# EAGLE design Crab_v2 (EAGLE 8.0.1)
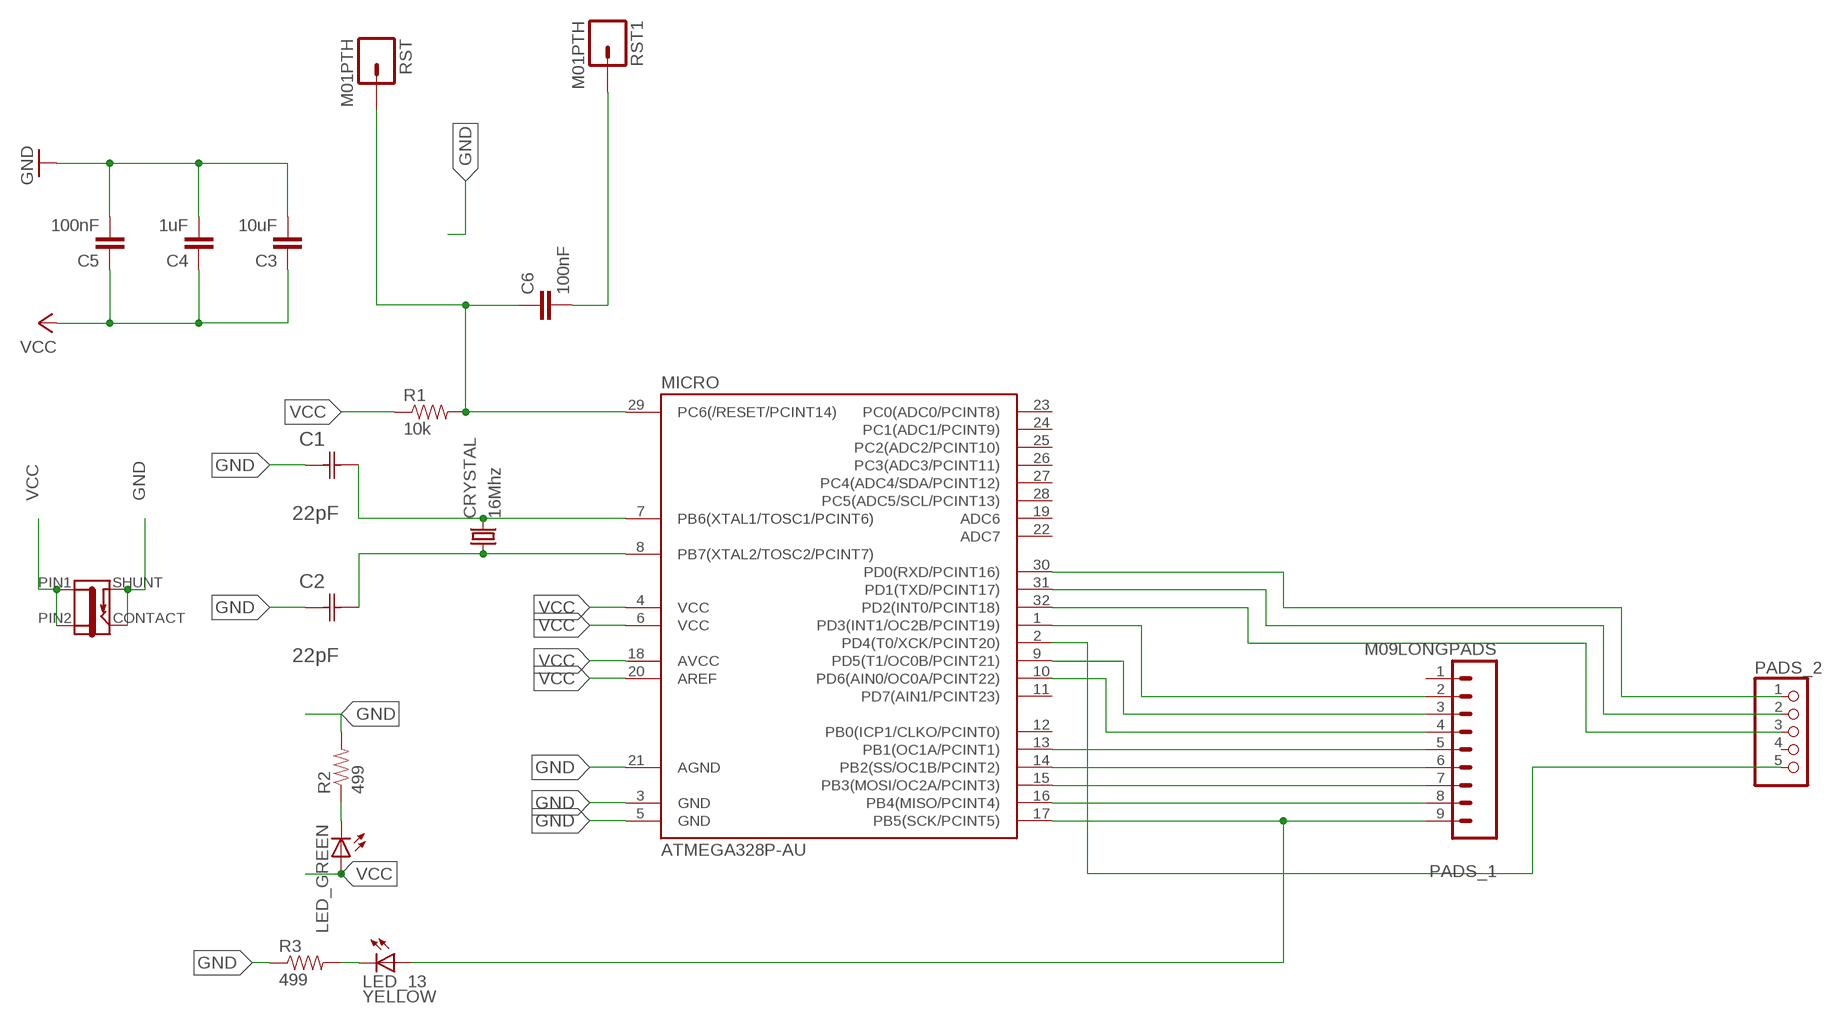
[diagram p0: schematic, sheet 1]

## Parts
C1  22pF  0612ZC225MAT2A  [CAPC3216X178N]
C2  22pF  0612ZC225MAT2A  [CAPC3216X178N]
C3  10uF  CAP1206  [1206]
C4  1uF  CAP1206  [1206]
C5  100nF  CAP1206  [1206]
C6  100nF  CAP1206  [1206]
CRYSTAL  16Mhz  CSM-7X-DU  [CSM-7X-DU]
J1  JACK-2.1MM  [PJ-002AH-SMT]
LED_13  YELLOW  LED1206  [1206]
LED_GREEN  LED1206  [1206]
MICRO  ATMEGA328P-AU  ATMEGA48/88/168-AU  [TQFP32-08]
PADS_1  M09LONGPADS  [1X09_LONGPADS]
PADS_2  PINHD-1X5  [1X05]
R1  10k  RESISTOR1206  [1206]
R2  499  RESISTOR1206  [1206]
R3  499  RESISTOR1206  [1206]
RST  M01PTH  [1X01]
RST1  M01PTH  [1X01]

## Nets
GND: C1.1(C1) C2.1(C1) C3.2 C4.2 C5.2 J1.CONTACT J1.SHUNT MICRO.3(GND) MICRO.5(GND) MICRO.21(AGND) R2.2 R3.1
N$1: MICRO.10(PD6(AIN0/OC0A/PCINT22)) PADS_1.4
N$2: C1.2(C2) CRYSTAL.2 MICRO.7(PB6(XTAL1/TOSC1/PCINT6))
N$3: MICRO.9(PD5(T1/OC0B/PCINT21)) PADS_1.3
N$4: MICRO.1(PD3(INT1/OC2B/PCINT19)) PADS_1.2
N$7: MICRO.13(PB1(OC1A/PCINT1)) PADS_1.5
N$8: MICRO.14(PB2(SS/OC1B/PCINT2)) PADS_1.6
N$9: C2.2(C2) CRYSTAL.1 MICRO.8(PB7(XTAL2/TOSC2/PCINT7))
N$10: MICRO.15(PB3(MOSI/OC2A/PCINT3)) PADS_1.7
N$11: MICRO.16(PB4(MISO/PCINT4)) PADS_1.8
N$12: LED_13.1(A) MICRO.17(PB5(SCK/PCINT5)) PADS_1.9
N$13: C6.2 RST1.1
N$20: MICRO.30(PD0(RXD/PCINT16)) PADS_2.1
N$21: MICRO.31(PD1(TXD/PCINT17)) PADS_2.2
N$22: MICRO.32(PD2(INT0/PCINT18)) PADS_2.3
N$24: MICRO.2(PD4(T0/XCK/PCINT20)) PADS_2.5
N$26: LED_GREEN.2(C) R2.1
N$27: LED_13.2(C) R3.2
N$28: C6.1 MICRO.29(PC6(/RESET/PCINT14)) R1.2 RST.1
VCC: C3.1 C4.1 C5.1 J1.PIN1 J1.PIN2 LED_GREEN.1(A) MICRO.4(VCC) MICRO.6(VCC) MICRO.18(AVCC) MICRO.20(AREF) R1.1
Unconnected: MICRO.11(PD7(AIN1/PCINT23)) MICRO.12(PB0(ICP1/CLKO/PCINT0)) MICRO.19(ADC6) MICRO.22(ADC7) MICRO.23(PC0(ADC0/PCINT8)) MICRO.24(PC1(ADC1/PCINT9)) MICRO.25(PC2(ADC2/PCINT10)) MICRO.26(PC3(ADC3/PCINT11)) MICRO.27(PC4(ADC4/SDA/PCINT12)) MICRO.28(PC5(ADC5/SCL/PCINT13)) PADS_1.1 PADS_2.4

## Library data of the parts
C1 C2 = AVX_By_element14_Batch_1:0612ZC225MAT2A: Capacitor 1206; MPN: 0612ZC225MAT2A; OC_FARNELL: -; OC_NEWARK: 12N3209; SUPPLIER: AVX; TOLERANCE: ±20%; VALUE: 2.2µF; VOLTAGERATING: 10V
C3-C6 = 01_SparkFun:CAP: Capacitor Standard 0603 ceramic capacitor, and 0.1" leaded capacitor.
CRYSTAL = 01_FAB_Hello:CSM-7X-DU: SMD CRYSTAL Source: www.ecsxtal.com .. Crystal 3.6864MHz CSM_7X_DU.PDF; OC_FARNELL: unknown; OC_NEWARK: unknown
J1 = fab:JACK-2.1MM: SMD DC power jack PJ-002AH-SMT As found in the fablab inventory. Made by Zaerc.
LED_13 LED_GREEN = 01_FAB_Hello:LED
MICRO = atmega8:ATMEGA48/88/168
PADS_1 = 01_SparkFun:M09: Header 9 Standard 9-pin 0.1" header. Use with straight break away headers (SKU : PRT-00116), right angle break away headers (PRT-00553), swiss pins (PRT-00743), machine pins (PRT-00117), and female headers (PRT-00115).
PADS_2 = pinhead:PINHD-1X5: PIN HEADER
R1-R3 = 01_SparkFun:RESISTOR: Resistor Basic schematic elements and footprints for 0603, 1206, and PTH 1/10th watt (small) resistors.
RST RST1 = 01_SparkFun:M01: Header 1 Standard 1-pin 0.1" header. Use with straight break away headers (SKU : PRT-00116), right angle break away headers (PRT-00553), swiss pins (PRT-00743), machine pins (PRT-00117), and female headers (PRT-00115).

## Board
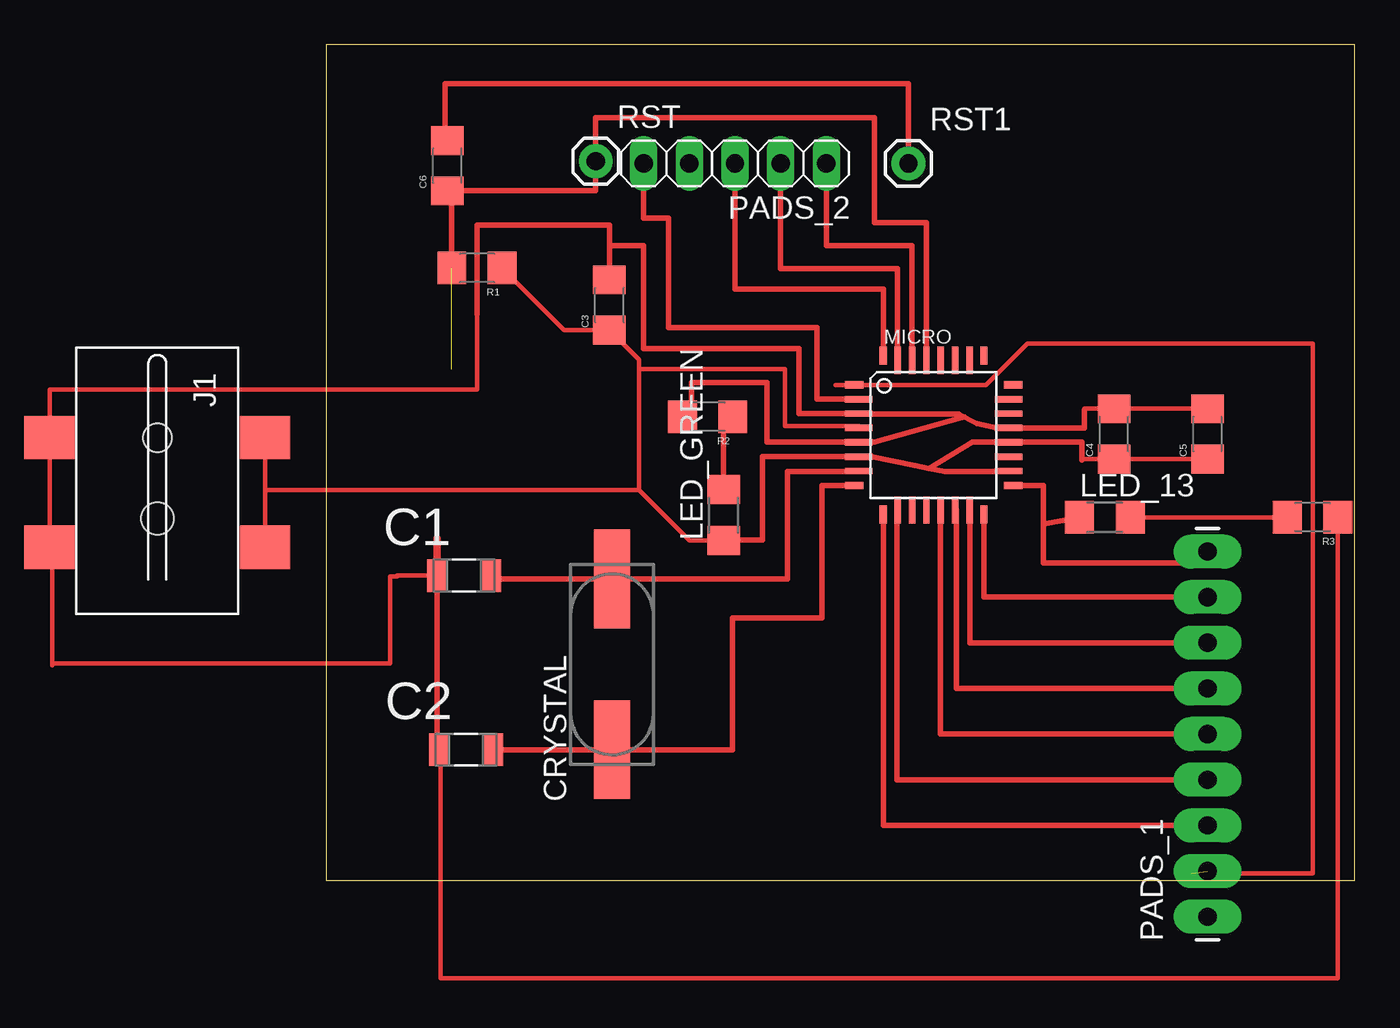
[diagram p1: board, top side]

Size 57.2 x 46.47 mm. Coordinates in mm from the lower left corner, seen from the top.
Outline: 0,0 57.2,0 57.2,46.47 0,46.47 0,0
Copper layers (1*16): Top 0.035mm / dielectric 1.5mm / Bottom 0.035mm
Design rules "fab": minimum track width 0.3mm, minimum drill 32mil, track to track 0.315mm, track to pad 0.315mm, pad to pad 0.315mm, via to via 0.315mm, smd to smd 0.315mm, copper to edge 40mil, drill to drill 16mil, minimum pad ring 10mil, minimum via ring 8mil, stop-mask expansion 4mil, vias tented up to drill 0mil, thermal gap 10mil

### Footprints (pad centres in the part's own frame; a part is rotated, then mirrored left to right if it is on the bottom)
CAPC3216X178N = smd 1.118 x 1.803: 1 -1.499,0; 2 1.499,0
1206 = smd 1.6 x 1.8: 1 -1.4,0; 2 1.4,0
CSM-7X-DU = smd 5.5 x 2: 1 -4.75,0; 2 4.75,0
PJ-002AH-SMT = smd 2.4 x 2.8: CONTACT -2.4,-6; PIN1 3.7,6; PIN2 -2.4,6; SHUNT 3.7,-6 | hole 1.6: -2.4,0 | hole 1.8: 2.1,0
1206' = smd 1.6 x 1.803: 1 -1.422,0; 2 1.422,0
TQFP32-08 = smd 1.016 x 0.406: 1 -4.42,2.8; 8 -4.42,-2.8; 17 4.42,-2.8; 24 4.42,2.8 | smd 1.524 x 0.356: 2 -4.166,2; 3 -4.166,1.2; 4 -4.166,0.4; 5 -4.166,-0.4; 6 -4.166,-1.2; 7 -4.166,-2; 18 4.166,-2; 19 4.166,-1.2; 20 4.166,-0.4; 21 4.166,0.4; 22 4.166,1.2; 23 4.166,2 | smd 0.406 x 1.016: 9 -2.8,-4.42; 16 2.8,-4.42; 25 2.8,4.42; 32 -2.8,4.42 | smd 0.356 x 1.524: 10 -2,-4.166; 11 -1.2,-4.166; 12 -0.4,-4.166; 13 0.4,-4.166; 14 1.2,-4.166; 15 2,-4.166; 26 2,4.166; 27 1.2,4.166; 28 0.4,4.166; 29 -0.4,4.166; 30 -1.2,4.166; 31 -2,4.166
1X09_LONGPADS = drill 1.016 pad 1.88 long: 1 0,0; 2 2.54,0; 3 5.08,0; 4 7.62,0; 5 10.16,0; 6 12.7,0; 7 15.24,0; 8 17.78,0; 9 20.32,0
1X05 = drill 1.016 long: 1 -5.08,0; 2 -2.54,0; 3 0,0; 4 2.54,0; 5 5.08,0
1X01 = drill 1.016 pad 1.88: 1 0,0

### Placement (x,y rotation side)
C1  7.67,16.94 0 top
C2  7.77,7.26 0 top
C3  15.75,32 90 top
C4  43.82,24.83 90 top
C5  49.02,24.83 90 top
C6  6.73,39.75 90 top
CRYSTAL  15.9,12.01 90 top
J1  -9.4,22.23 270 top  (outside the outline)
LED_13  YELLOW  [1206']  43.31,20.19 0 top
LED_GREEN  [1206']  22.1,20.32 90 top
MICRO  33.78,24.77 0 top
PADS_1  49.02,-2.03 90 top
PADS_2  22.73,39.88 180 top
R1  8.38,34.06 180 top
R2  21.21,25.78 180 top
R3  54.86,20.19 180 top
RST  14.99,40.01 0 top
RST1  32.39,39.88 0 top

### Tracks (layer width: path | path; a pad name or v marks a point on that pad's centre or on a via)
GND
  Top 0.254: R3.1 56.26,-5.08 56.26,-5.46 6.35,-5.46 6.35,7.26 C2.1 | 42.16,26.16 42.16,26.23 C4.2 C5.2 | C1.1 3.94,16.94 3.94,16.89 3.56,16.89 3.56,12.07 -15.24,12.07 -15.24,11.94 -15.24,18.37 J1.SHUNT J1.CONTACT -15.4,27.3 8.38,27.3 8.38,31.5
  Top 0.305: MICRO.5 | MICRO.21 | C2.1 6.17,7.26 C1.1 6.1,16.94 | MICRO.5 29.62,24.38 24.51,24.38 24.51,27.69 20.32,27.69 20.32,25.65 R2.2 20.32,25.91 | MICRO.5 30.23,24.38 30.48,24.38 35.36,25.73 | MICRO.21 37.34,25.15 36.2,25.4 35.17,25.94 | 15.75,35.31 17.65,35.31 17.65,29.59 26.29,29.59 26.29,25.96 MICRO.3 29.64,25.94 35.17,25.94 | 35.36,25.73 35.49,25.77 | 35.17,25.94 35.36,25.73 | C3.2 15.75,35.31 | 8.38,31.5 8.38,36.45 15.75,36.45 15.75,35.31 | MICRO.21 42.16,25.16 42.16,26.16 | C5.2 49.02,26.16
  Top 0.406: 6.17,19.02 C1.1
N$1
  Top 0.305: MICRO.10 31.75,20.6 31.75,5.59 PADS_1.4
N$2
  Top 0.305: 9.17,16.76 C1.2 9.17,16.76 | MICRO.7 29.62,22.73 25.65,22.73 25.65,16.76 CRYSTAL.2 9.17,16.76
N$3
  Top 0.305: PADS_1.3 30.98,3.05 MICRO.9
N$4  (1 unrouted)
  Top 0.254: 48.13,0.38 54.86,0.38 54.86,29.84 38.99,29.84 36.7,27.56 MICRO.1 28.32,27.56
N$7
  Top 0.305: MICRO.13 34.16,20.6 34.16,8.13 PADS_1.5
N$8
  Top 0.305: MICRO.14 35.05,20.6 35.05,10.67 PADS_1.6
N$9
  Top 0.305: 9.27,7.24 C2.2 | MICRO.8 27.56,21.97 27.56,14.61 22.61,14.61 22.61,7.24 15.9,7.24 CRYSTAL.1 C2.2 | C2.2
N$10
  Top 0.305: MICRO.15 35.81,20.6 35.81,13.21 PADS_1.7
N$11
  Top 0.305: MICRO.16 | MICRO.16 36.58,15.75 PADS_1.8
N$12
  Top 0.305: PADS_1.9 49.53,17.65 39.88,17.65 39.88,19.81 | LED_13.1 39.88,19.81 | MICRO.17 39.88,21.96 39.88,19.81
N$13
  Top 0.305: C6.2 6.6,41.15 6.6,44.32 32.39,44.32 RST1.1
N$20
  Top 0.305: PADS_2.1 27.81,35.31 32.58,35.31 MICRO.30
N$21
  Top 0.305: PADS_2.2 25.27,34.04 31.78,34.04 MICRO.31
N$22
  Top 0.305: MICRO.32 30.99,32.89 22.73,32.89 PADS_2.3
N$24
  Top 0.305: MICRO.2 27.3,26.77 27.3,30.73 19.05,30.73 19.05,36.83 17.65,36.83 PADS_2.5
N$26
  Top 0.305: 22.99,25.53 R2.1 22.61,25.4 22.1,25.4 LED_GREEN.2
N$27
  Top 0.254: LED_13.2 R3.2
N$28  (1 unrouted)
  Top 0.305: 33.4,28.93 MICRO.29 33.38,36.58 30.48,36.58 30.48,42.42 14.99,42.42 RST.1 14.99,38.35 6.98,38.35 | 6.73,34.06 R1.2 6.98,38.35 | C6.1 6.98,38.35
VCC
  Top 0.254: 42.04,23.37 42.04,23.43 C4.1 C5.1 | J1.PIN1 J1.PIN2 -3.4,21.72 17.4,21.72 | 17.4,21.72 20.22,18.9 LED_GREEN.1 | R1.1 13.24,30.6 C3.1 17.4,28.95 17.4,28.45 | 17.4,28.45 17.4,21.72 | MICRO.4 29.62,25.27 25.53,25.27 25.53,28.45 17.4,28.45
  Top 0.305: MICRO.18 37.95,22.73 34.42,22.73 33.51,22.92 | MICRO.20 | LED_GREEN.1 22.1,18.92 24.26,18.92 24.26,23.57 MICRO.6 30.3,23.57 32.76,23.07 33.51,22.92 | 33.51,22.92 35.94,24.38 MICRO.20 | C3.1 16.13,30.6 16.13,30.35 | MICRO.20 42.04,24.37 42.04,23.37 | C5.1 49.02,23.37